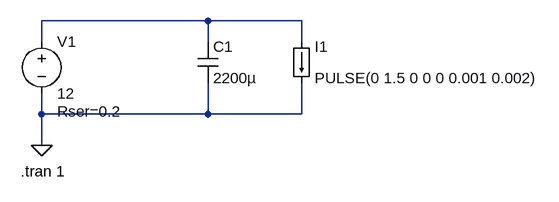
[diagram p0: schematic Filter.asc]
Filter.asc, the LTspice schematic file:
Version 4
SHEET 1 948 680
WIRE 384 80 128 80
WIRE 528 80 384 80
WIRE 128 112 128 80
WIRE 384 112 384 80
WIRE 528 112 528 80
WIRE 128 224 128 192
WIRE 384 224 384 176
WIRE 384 224 128 224
WIRE 528 224 528 176
WIRE 528 224 384 224
WIRE 128 272 128 224
FLAG 128 272 0
SYMBOL voltage 128 96 R0
WINDOW 123 0 0 Left 2
WINDOW 39 24 124 Left 2
SYMATTR SpiceLine Rser=0.2
SYMATTR InstName V1
SYMATTR Value 12
SYMBOL cap 368 112 R0
SYMATTR InstName C1
SYMATTR Value 2200µ
SYMATTR SpiceLine Rser=20m
SYMBOL load 512 112 R0
WINDOW 123 0 0 Left 2
WINDOW 39 0 0 Left 2
SYMATTR InstName I1
SYMATTR Value PULSE(0 1.5 0 0 0 0.001 0.002)
TEXT 96 312 Left 2 !.tran 1

The netlist it stands for:
* Filter.asc
V1 N001 0 12 Rser=0.2
C1 N001 0 2200µ Rser=20m
I1 N001 0 PULSE(0 1.5 0 0 0 0.001 0.002)
.tran 1
.backanno
.end